# Altium project PCB_tesis.PrjPcb (part 1 of 2)
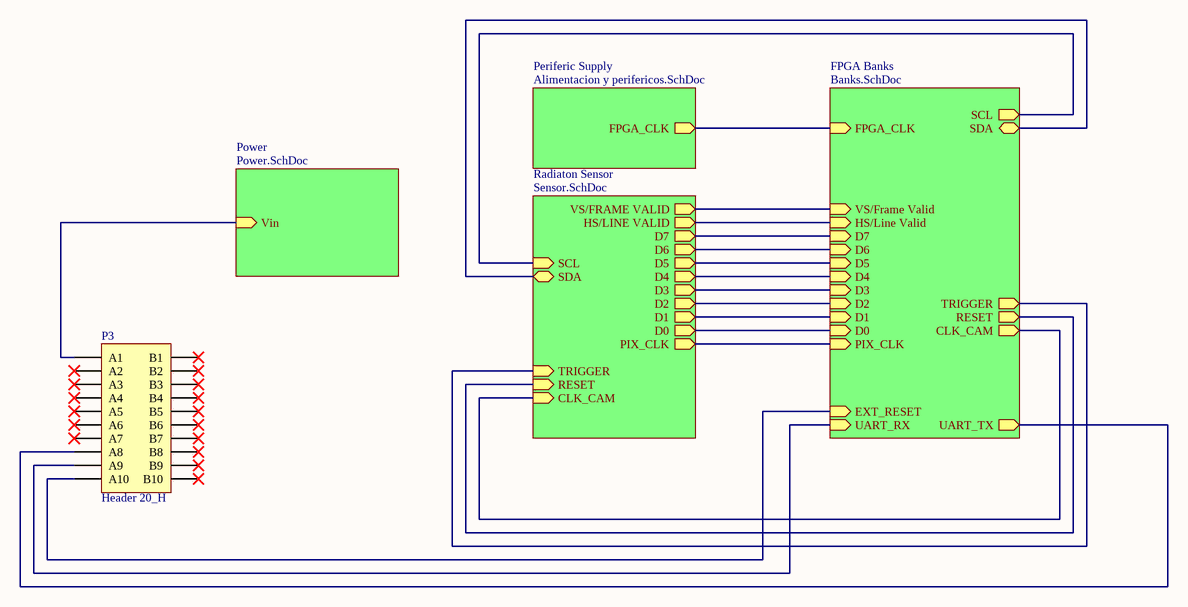
[diagram p0: Sistema.SchDoc]
4 sheets, 76 parts. Net scope: hierarchical (ports join the sheet entries above them; power ports are global).
Board file: Sistema.PcbDoc
Sheets:
  Sistema.SchDoc
    Power = Power.SchDoc
    Periferic Supply = Alimentacion y perifericos.SchDoc
    FPGA Banks = Banks.SchDoc

## Sheet Sistema.SchDoc
size A4; SheetNumber: 1; SheetTotal: 5

### Parts
P3  Header 20_H  [P_DIN41612-20-H]

### Sub-sheets
FPGA Banks = Banks.SchDoc: FPGA_CLK (in), SCL (out), SDA (bidir), VS/Frame Valid (in), HS/Line Valid (in), D7 (in), D6 (in), D5 (in), D4 (in), D3 (in), D2 (in), D1 (in), PIX_CLK (in), CLK_CAM (out), D0 (in), TRIGGER (out), RESET (out), EXT_RESET (in), UART_TX (out), UART_RX (in)
Periferic Supply = Alimentacion y perifericos.SchDoc: FPGA_CLK (out)
Power = Power.SchDoc: Vin (in)
Radiaton Sensor = Sensor.SchDoc (file not in this document): VS/FRAME VALID (out), SDA (bidir), SCL (in), RESET (in), PIX_CLK (out), HS/LINE VALID (out), D7 (out), D6 (out), D5 (out), D4 (out), D3 (out), D2 (out), D1 (out), D0 (out), CLK_CAM (in), TRIGGER (in)

### Nets
NetC9_2: P3.A10 ; sheet FPGA Banks/EXT_RESET
NetF1_1: P3.A1 ; sheet Power/Vin
NetP3_A8: P3.A8 ; sheet FPGA Banks/UART_TX
NetP3_A9: P3.A9 ; sheet FPGA Banks/UART_RX
NetR11_1: sheet Periferic Supply/FPGA_CLK, sheet FPGA Banks/FPGA_CLK
NetU7_7: sheet FPGA Banks/SCL, sheet Radiaton Sensor/SCL
NetU7_8: sheet FPGA Banks/SDA, sheet Radiaton Sensor/SDA
NetU7_9: sheet FPGA Banks/VS/Frame Valid, sheet Radiaton Sensor/VS/FRAME VALID
NetU7_10: sheet FPGA Banks/HS/Line Valid, sheet Radiaton Sensor/HS/LINE VALID
NetU7_11: sheet FPGA Banks/D7, sheet Radiaton Sensor/D7
NetU7_12: sheet FPGA Banks/D6, sheet Radiaton Sensor/D6
NetU7_15: sheet FPGA Banks/D5, sheet Radiaton Sensor/D5
NetU7_16: sheet FPGA Banks/D4, sheet Radiaton Sensor/D4
NetU7_17: sheet FPGA Banks/D3, sheet Radiaton Sensor/D3
NetU7_18: sheet FPGA Banks/D2, sheet Radiaton Sensor/D2
NetU7_19: sheet FPGA Banks/D1, sheet Radiaton Sensor/D1
NetU7_20: sheet FPGA Banks/PIX_CLK, sheet Radiaton Sensor/PIX_CLK
NetU7_21: sheet FPGA Banks/CLK_CAM, sheet Radiaton Sensor/CLK_CAM
NetU7_22: sheet FPGA Banks/D0, sheet Radiaton Sensor/D0
NetU7_23: sheet FPGA Banks/TRIGGER, sheet Radiaton Sensor/TRIGGER
NetU7_24: sheet FPGA Banks/RESET, sheet Radiaton Sensor/RESET

Not connected (* = marked no-connect by the designer): P3 A2* A3* A4* A5* A6* A7* B1* B2* B3* B4* B5* B6* B7* B8* B9* B10*

### Library data of the parts
P3 = P_Conector_20_H: Conector 20 Position Din Connector Plug, Male Pins Gold Through Hole, Right Angle; Manufacturer: HARTING Technology; Manufacturer Part Number: 09242206825; Current Rating: 2A; Gender: Female; Connector Type: Receptacle; Number of Positions: 20; Pitch: 2.54mm; Tail Length: 4.5mm; Mounting Technology: Through Hole; Contact Material: Copper Alloy; Contact Plating: Gold; Insulation Material: Glass; Housing Material: Thermoplastic; Shell Size: 3B; Packaging: Bulk; Package Quantity: 20; Number of Rows: 2; Termination: Solder; Number of Contacts: 20; Orientation: Straight; Series: DIN 41612; Lead Free: Lead Free; Flammability Rating: UL94 V-0; RoHS Compliant: Yes; ComponentLink1URL: https://datasheet.ciiva.com/11731/0900766b811d3497-11731844.pdf?src-supplier=Rs; ComponentLink1Description: https://datasheet.ciiva.com/11731/0900766b811d3497-11731844.pdf?src-supplier=Rs; Supplier 1: Mouser; Supplier Part Number 1: 617-09-24-220-6825; RoHS: Yes; Category: DIN 41612 Connectors; Stock 1: 166; Pricing 1: 1=4,87, 10=4,27, 50=4,27, 100=3,55, 1000=2,94, 10000=2,74 (USD); Value: Header 20_H

## Sheet Power.SchDoc
size A4; SheetNumber: 5; SheetTotal: 5
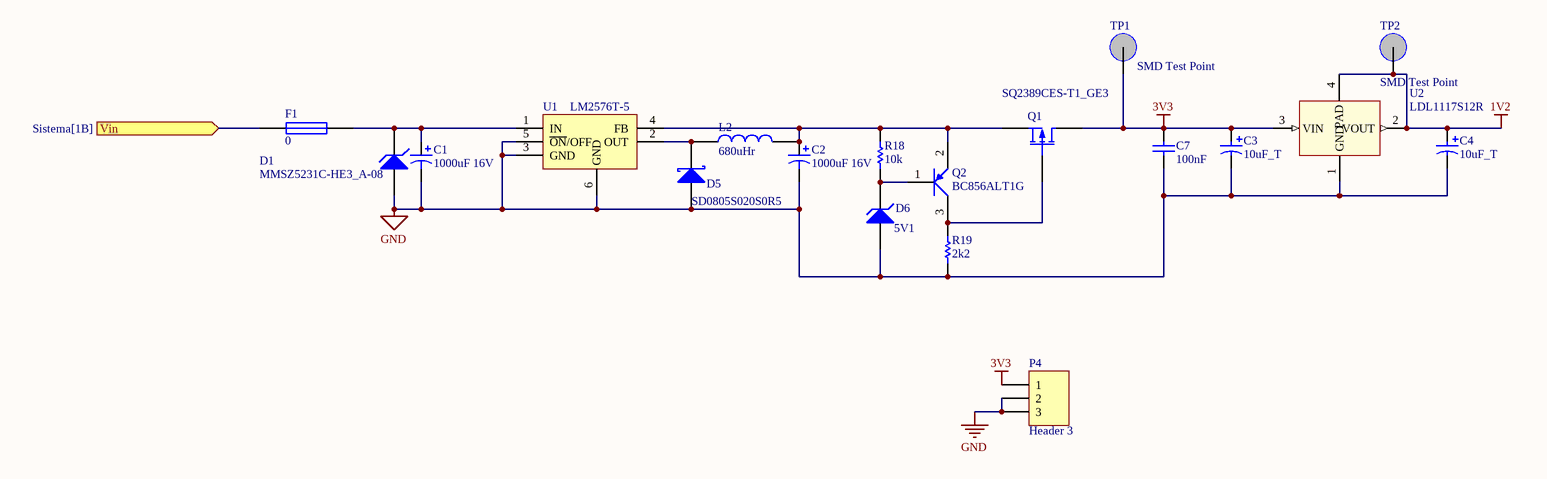
[diagram p1: Power.SchDoc]

### Parts
C1  1000uF 16V  [C_SMD_F12]
C2  1000uF 16V  [C_SMD_F12]
C3  10uF_T  [C_0805_2013_c]
C4  10uF_T  [C_0805_2013_c]
C7  100nF  [C_0805_2013_b]
D1  MMSZ5231C-HE3_A-08  [D_SOD-123]
D5  SD0805S020S0R5  [D_SOD-123]
D6  5V1  [D_SOD-123]
F1  0  [F_0805_2012]
L2  680uHr  [L_SMD_10x10]
P4  Header 3  [P_HDR1X3_3D]
Q1  SQ2389CES-T1_GE3  [Q_SOT-23]
Q2  BC856ALT1G  [Q_SOT-23B_N]
R18  10k  [R_0805_2012_a]
R19  2k2  [R_0805_2012_a]
TP1  SMD Test Point  [TP SMD]
TP2  SMD Test Point  [TP SMD]
U1  LM2576T-5  [U_SMD_TO-263-5]
U2  LDL1117S12R  [U_SOT-223]

### Ports
Vin (in, see Sistema[1B])

### Nets
1V2: C4.1 TP2.1 U2.2(VOUT) U2.4(PAD)
3V3: C3.1 C7.2 P4.1 Q1.3(D) TP1.1 U2.3(VIN)
GND: C1.2 C2.2 C3.2 C4.2 C7.1 D1.2(A) D5.2(A) D6.2(A) P4.2 P4.3 R19.2 U1.3(GND) U1.5(~{O}~{N}/OFF) U1.6(GND) U2.1(GND)
NetC1_1: C1.1 D1.1(K) F1.2 U1.1(IN)
NetC2_1: C2.1 L2.2 Q1.2(S) Q2.2(E) R18.2 U1.4(FB)
NetD5_1: D5.1(K) L2.1 U1.2(OUT)
NetD6_1: D6.1(K) Q2.1(B) R18.1
NetF1_1: F1.1 ; port Vin
NetQ1_1: Q1.1(G) Q2.3(C) R19.1

### Library data of the parts
C1 C2 = C_1000uF_16V_p: Capacitor SMD Elec F12; Manufacturer: KEMET; Manufacturer Part Number: A768MS108M1CLAE015; Supplier 1: Mouser; Supplier Part Number 1: 80-A768MS108M1CLAE15; RoHS: Yes; Category: Polymer Capacitors; Stock 1: 5839; Pricing 1: 1=0,91, 10=0,572, 50=0,572, 100=0,466, 1000=0,307, 10000=0,275 (USD); Value: 1000uF 16V
C3 C4 = C_10uF_10V_b: Capacitor SMD 0805 Tant; Manufacturer: Vishay; Manufacturer Part Number: TMCP1A106MTRF; RoHS Compliant: Yes; Supplier 1: Mouser; Supplier Part Number 1: 74-TMCP1A106MTRF; RoHS: Yes; Category: Tantalum Capacitors; Stock 1: 7293; Pricing 1: 1=0,3, 10=0,152, 50=0,152, 100=0,098, 1000=0,082, 10000=0,067 (USD); Value: 10uF_T
C7 = C_100nF_50V_b: Capacitor SMD 0805; Manufacturer: Yageo; Manufacturer Part Number: CC0805KRX7R9BB104; Material: Ceramic; Tolerance: 10%; Dielectric: X7R; Voltage: 50V; Insulation Resistance: 100GR; Mounting Technology: Surface Mount; Case/Package: 0805; Pins: 2; Case Code (Metric): 2012; Case Code (Imperial): 0805; Min Operating Temperature: -55°C; Max Operating Temperature: 125°C; Packaging: Tape and Reel; Voltage Rating: 50V; Package Quantity: 4000; Termination: SMD/SMT; Series: CC; Length: 2mm; Height: 0.85mm; Depth: 1.25mm; Radiation Hardening: No; RoHS Compliant: Yes; Reach SVHC Compliant: No; Halogen Free: 5694HalogenFree; Lead Free: 5697LeadFree; ComponentLink1URL: https://datasheet.ciiva.com/11786/0900766b80d84f1d-11786009.pdf?src-supplier=Rs; ComponentLink1Description: https://datasheet.ciiva.com/11786/0900766b80d84f1d-11786009.pdf?src-supplier=Rs; ComponentLink2URL: https://datasheet.ciiva.com/46393/1734573-46393307.pdf?src-supplier=Element14; ComponentLink2Description: https://datasheet.ciiva.com/46393/1734573-46393307.pdf?src-supplier=Element14; ComponentLink3URL: https://datasheet.ciiva.com/155/mlccorderingcode-155930.pdf?src-supplier=Digikey; ComponentLink3Description: https://datasheet.ciiva.com/155/mlccorderingcode-155930.pdf?src-supplier=Digikey; ComponentLink4URL: https://datasheet.ciiva.com/155/mlccorderingcode-155929.pdf?src-supplier=Digikey; ComponentLink4Description: https://datasheet.ciiva.com/155/mlccorderingcode-155929.pdf?src-supplier=Digikey; ComponentLink5URL: https://datasheet.ciiva.com/155/mlccorderingcode-155931.pdf?src-supplier=Digikey; ComponentLink5Description: https://datasheet.ciiva.com/155/mlccorderingcode-155931.pdf?src-supplier=Digikey; ComponentLink6URL: https://datasheet.ciiva.com/11464/upy-gphc-x7r-6-3v-to-50v-8-11464757.pdf?src-supplier=Avnet; ComponentLink6Description: https://datasheet.ciiva.com/11464/upy-gphc-x7r-6-3v-to-50v-8-11464757.pdf?src-supplier=Avnet; ComponentLink7URL: https://datasheet.ciiva.com/28450/1489800-28450805.pdf?src-supplier=Element14; ComponentLink7Description: https://datasheet.ciiva.com/28450/1489800-28450805.pdf?src-supplier=Element14; ComponentLink8URL: https://datasheet.ciiva.com/29242/445210-da-01-en-kerko-chip-0805-x7r-0-1uf-10proz-50vg-29242074.pdf?src-supplier=Conrad; ComponentLink8Description: https://datasheet.ciiva.com/29242/445210-da-01-en-kerko-chip-0805-x7r-0-1uf-10proz-50vg-29242074.pdf?src-supplier=Conrad; Supplier 1: Digikey; Supplier Part Number 1: 311-1140-1-ND; RoHS: Yes; Category: Ceramic Capacitors; Stock 1: 5306374; Pricing 1: 1=0,1, 10=0,07, 50=0,0418, 100=0,0329, 500=0,02428, 1000=0,0201 (USD); Value: 100nF
D1 = D_MMSZ5231C-HE3_A-08: Diode SMD SOD-123 Zener 5V1; Manufacturer: Vishay Semiconductors; Manufacturer Part Number: MMSZ5226C-E3-08; Zener Voltage: 3.3V; Max Power Dissipation: 500mW; Impedance: 28R; Zener Current: 20mA; Voltage Tolerance: 2%; Max Reverse Leakage Current: 25uA; Mounting Technology: Surface Mount; Weight: 0.000363oz; Min Operating Temperature: -55°C; Max Operating Temperature: 150°C; Packaging: Tape and Reel; Package Quantity: 3000; Power Dissipation: 500mW; Tolerance: 2%; Series: Automotive, AEC-Q101; RoHS Compliant: Yes; ComponentLink1URL: https://www.vishay.com/docs/86344/mmsz5225_to_mmsz5267.pdf; ComponentLink1Description: Datasheet; RoHS: Yes; Category: Zener Diodes; Stock 1: 14347; Pricing 1: 1=0,29, 10=0,198, 50=0,198, 100=0,089, 1000=0,062, 10000=0,041 (USD); Value: MMSZ5231C-HE3_A-08; Supplier 1: Mouser; Supplier Part Number 1: 78-MMSZ5231CHE3_A-08
D5 = D_SD0805S020S0R5: Diode SMD D_SD0805S020S0R5; Manufacturer: Diodes; Manufacturer Part Number: B550C-13-F; Max Reverse Current: 500uA; Forward Current: 5A; Max Repetitive Reverse Voltage (Vrrm): 50V; Peak Non-Repetitive Surge Current: 100A; Polarity: Standard; Forward Voltage: 700mV; Mounting Technology: Surface Mount; Case/Package: SMC; Pins: 2; Weight: 0.007408oz; Contact Plating: Tin,Matte; Min Operating Temperature: -55°C; Max Operating Temperature: 125°C; Package Quantity: 3000; Packaging: Tape and Reel; Current Rating: 5A; Output Current: 5A; Series: -; Average Rectified Current: 5A; Max Forward Surge Current (Ifsm): 100A; Termination: SMD/SMT; Voltage Rating (DC): 50V; Max Reverse Voltage (DC): 50V; Length: 7.11mm; Width: 6.22mm; Height: 2.5mm; Radiation Hardening: No; Lead Free: Lead Free; RoHS Compliant: Yes; Reach SVHC Compliant: No; RoHS: Yes; Category: Rectifier Diodes; Stock 1: 65197; Pricing 1: 1=0,56, 10=0,476, 100=0,3309, 500=0,25834, 1000=0,20998 (USD); Value: SD0805S020S0R5; Supplier 1: Digikey; Supplier Part Number 1: 478-7799-1-ND
D6 = D_DDZ5V1B-7: Zener Diode; Manufacturer: Diodes; Max Power Dissipation: 500mW; Zener Voltage: 5.1V; Max Reverse Leakage Current: 5uA; Tolerance: 3%; Forward Voltage: 900mV; Impedance: 17R; Test Current: 20mA; Output Current: 40mA; Mounting Technology: Surface Mount; Case/Package: SOD-123-2; Pins: 2; Weight: 0.000353oz; Min Operating Temperature: -65°C; Max Operating Temperature: 150°C; Package Quantity: 3000; Packaging: Tape and Reel; Voltage Tolerance: 3%; Power Rating: 500mW; Series: -; Zener Current: 5uA; Max Reverse Current: 5uA; Power Dissipation: 500mW; Working Voltage: 5.1V; Termination: SMD/SMT; Voltage Rating (DC): 5.1V; Length: 3.85mm; Width: 1.7mm; Height: 1.35mm; Radiation Hardening: No; RoHS Compliant: Yes; Lead Free: Lead Free; ComponentLink1URL: http://components.arrow.com/part/dataview/41508659S7354897N2868?src-supplier=Arrow+Electronics; ComponentLink1Description: http://components.arrow.com/part/dataview/41508659S7354897N2868?src-supplier=Arrow+Electronics; ComponentLink2URL: http://www.mouser.com/ds/2/115/ds30407-71565.pdf?src-supplier=Mouser; ComponentLink2Description: http://www.mouser.com/ds/2/115/ds30407-71565.pdf?src-supplier=Mouser; ComponentLink3URL: http://www.diodes.com///datasheets/ds30407.pdf?src-supplier=Avnet; ComponentLink3Description: http://www.diodes.com///datasheets/ds30407.pdf?src-supplier=Avnet; ComponentLink4URL: http://www.diodes.com//datasheets/ds30407.pdf?src-supplier=Avnet; ComponentLink4Description: http://www.diodes.com//datasheets/ds30407.pdf?src-supplier=Avnet; ComponentLink5URL: https://datasheet.octopart.com/DDZ5V1B-7-Diodes-Inc.-datasheet-160462869.pdf?src-supplier=Farnell; ComponentLink5Description: https://datasheet.octopart.com/DDZ5V1B-7-Diodes-Inc.-datasheet-160462869.pdf?src-supplier=Farnell; ComponentLink6URL: http://www.diodes.com/_files/datasheets/ds30407.pdf?src-supplier=Future+Electronics; ComponentLink6Description: http://www.diodes.com/_files/datasheets/ds30407.pdf?src-supplier=Future+Electronics; ComponentLink7URL: https://www.diodes.com/assets/Datasheets/Ds30407.pdf?src-supplier=Digikey; ComponentLink7Description: https://www.diodes.com/assets/Datasheets/Ds30407.pdf?src-supplier=Digikey; ComponentLink8URL: https://datasheet.octopart.com/DDZ5V1B-7-Diodes-Inc.-datasheet-22952792.pdf?src-supplier=Future+Electronics; ComponentLink8Description: https://datasheet.octopart.com/DDZ5V1B-7-Diodes-Inc.-datasheet-22952792.pdf?src-supplier=Future+Electronics; ComponentLink9URL: https://www.verical.com/server-webapp/html/getDatasheet?partID=95733&src-supplier=Verical; ComponentLink9Description: https://www.verical.com/server-webapp/html/getDatasheet?partID=95733&src-supplier=Verical; Supplier 1: Digikey; Supplier Part Number 1: DDZ5V1BDICT-ND; Manufacturer Part Number: DDZ5V1B-7; RoHS: Yes; Category: Zener Diodes; Stock 1: 88257; Pricing 1: 1=0,25, 10=0,172, 100=0,084, 500=0,07006, 1000=0,04868 (USD); Supplier 2: Mouser; Supplier Part Number 2: 621-DDZ5V1B-7; Stock 2: 108934; Pricing 2: 1=0,24, 10=0,161, 50=0,161, 100=0,084, 1000=0,048, 10000=0,028 (USD); Value: 5V1
F1 = F_?_0805: (Generico) Fuse SMD 0805; Origin: TAIWAN; Published: 8-Jun-2000; LatestRevisionDate: 17-Jul-2002; LatestRevisionNote: Re-released for DXP Platform.; PackageReference: PIN-W2/E2.8; Publisher: Altium Limited; PackageDescription: Thru-Hole; 2 Leads; Supplier 1: Digi-Key; Supplier Part Number 1: SF-1206S200-2CT-ND; Value: 0
L2 = L_?_5: (Generico)  Inductor SMD 10x10; Value: 0
P4 = P_Header 3: Header, 3-Pin; Value: Header 3
Q1 = Q_SQ2389CES-T1_GE3: Value: SQ2389CES-T1_GE3; Supplier 1: Mouser; Supplier Part Number 1: 78-SQ2389CES-T1_GE3
Q2 = Q_BC856: TRANS PNP 65V 0.1A SOT23; Manufacturer: ON Semiconductor; Max Power Dissipation: 300mW; Max Collector Current: 100mA; Transition Frequency: 100MHz; Emitter Base Voltage (VEBO): 5V; Collector Base Voltage (VCBO): 80V; Collector Emitter Saturation Voltage: -650mV; Collector-emitter Voltage-Max: 650mV; hFE Min: 125; Number of Elements: 1; Voltage Rating (DC): -65V; Current Rating: -100mA; ComponentLink1Description: Manufacturer Link; ComponentLink1URL: http://www.fairchildsemi.com/; ComponentLink2Description: Datasheet; ComponentLink2URL: http://www.fairchildsemi.com/ds/2N%2F2N3904.pdf; Case/Package: SOT-23-3; Pins: 3; Contact Plating: Tin,Matte; Min Operating Temperature: -55°C; Max Operating Temperature: 150°C; Package Quantity: 3000; Packaging: Tape and Reel; Collector Emitter Breakdown Voltage: 65V; Polarity: PNP; Clock Frequency: 100MHz; Gain Bandwidth Product: 100MHz; Series: -; Collector Emitter Voltage (VCEO): 65V; Frequency: 100MHz; Max Breakdown Voltage: 65V; Power Dissipation: 300mW; Length: 2.9mm; Width: 1.3mm; Height: 0.94mm; Radiation Hardening: No; Lead Free: Lead Free; RoHS Compliant: Yes; Reach SVHC Compliant: No; ComponentLink3URL: http://www.farnell.com/datasheets/1840529.pdf?src-supplier=Farnell; ComponentLink3Description: http://www.farnell.com/datasheets/1840529.pdf?src-supplier=Farnell; ComponentLink4URL: http://www.alliedelec.com/m/d/ae2fff4c1f3549b23e4cd9e6cc054b51.pdf?src-supplier=Allied+Electronics; ComponentLink4Description: http://www.alliedelec.com/m/d/ae2fff4c1f3549b23e4cd9e6cc054b51.pdf?src-supplier=Allied+Electronics; ComponentLink5URL: http://www.mouser.com/ds/2/308/BC856ALT1-D-249456.pdf?src-supplier=Mouser; ComponentLink5Description: http://www.mouser.com/ds/2/308/BC856ALT1-D-249456.pdf?src-supplier=Mouser; ComponentLink6URL: http://www.farnell.com/datasheets/1840529.pdf?src-supplier=Element14; ComponentLink6Description: http://www.farnell.com/datasheets/1840529.pdf?src-supplier=Element14; ComponentLink7URL: http://www.farnell.com/datasheets/1840529.pdf?src-supplier=Newark; ComponentLink7Description: http://www.farnell.com/datasheets/1840529.pdf?src-supplier=Newark; Supplier Part Number 1: 863-BC856ALT1G; Manufacturer Part Number: BC856ALT1G; RoHS: Yes; Category: BJTs; Stock 1: 30566; Pricing 1: 1=0,11, 10=0,071, 50=0,071, 100=0,034, 1000=0,021, 10000=0,015 (USD); Value: BC856ALT1G; Supplier 1: Mouser
R18 = R_10k_b: Resistor SMD 0805; Manufacturer: Yageo; Manufacturer Part Number: AC0805FR-0710KL; Tolerance: 1%; Power Rating: 125mW; Voltage Rating: 150V; Temperature Coefficient: 100ppm/°C; Case/Package: 0805; Case Code (Metric): 2012; Case Code (Imperial): 0805; Min Operating Temperature: -55°C; Max Operating Temperature: 155°C; Packaging: Tape and Reel; Package Quantity: 1; Number of Terminations: 2; Termination: SMD/SMT; Max Power Dissipation: 125mW; Features: Moisture Resistant,Automotive AEC-Q200,Anti-Sulfur; Series: AC; Construction: Rectangular; Length: 0.079inch; Width: 0.049inch; Height: 0.024inch; Depth: 1.25mm; Military Standard: Not; Lead Free: Lead Free; RoHS Compliant: Yes; ComponentLink1URL: http://www.yageo.com/NewPortal/yageodocoutput?fileName=/pdf/R-Chip/PYu-AC_51_RoHS_L_6.pdf&src-supplier=Digikey; ComponentLink1Description: http://www.yageo.com/NewPortal/yageodocoutput?fileName=/pdf/R-Chip/PYu-AC_51_RoHS_L_6.pdf&src-supplier=Digikey; ComponentLink2URL: http://www.yageo.com/documents/recent/PYu-AC_51_RoHS_L_2_revised.pdf?src-supplier=Future+Electronics; ComponentLink2Description: http://www.yageo.com/documents/recent/PYu-AC_51_RoHS_L_2_revised.pdf?src-supplier=Future+Electronics; ComponentLink3URL: http://www.yageo.com/NewPortal/yageodocoutput?fileName=/pdf/R-Chip/PYu-AC_51_RoHS_L_6.pdf&src-supplier=NAC+Semi; ComponentLink3Description: http://www.yageo.com/NewPortal/yageodocoutput?fileName=/pdf/R-Chip/PYu-AC_51_RoHS_L_6.pdf&src-supplier=NAC+Semi; ComponentLink4URL: http://www.yageo.com/NewPortal/yageodocoutput?fileName=/pdf/R-Chip/PYu-AC_51_RoHS_L_6.pdf&src-supplier=Rutronik; ComponentLink4Description: http://www.yageo.com/NewPortal/yageodocoutput?fileName=/pdf/R-Chip/PYu-AC_51_RoHS_L_6.pdf&src-supplier=Rutronik; Supplier 1: Digikey; Supplier Part Number 1: 311-10KLGCT-ND; RoHS: Yes; Category: Chip SMD Resistors; Stock 1: 480247; Pricing 1: 1=0,1, 10=0,031, 50=0,0198, 100=0,0166, 500=0,01152, 1000=0,00997 (USD); Value: 10k
R19 = R_2k2_b: Resistor SMD 0805; Manufacturer: Bourns; Manufacturer Part Number: CR0805-FX-2201ELF; Voltage Rating: 150V; Tolerance: 1%; Power Rating: 125mW; Temperature Coefficient: 100ppm/°C; Mounting Technology: Surface Mount; Case/Package: 0805; Contact Plating: Tin; Case Code (Imperial): 0805; Case Code (Metric): 2012; Min Operating Temperature: -55°C; Max Operating Temperature: 155°C; Packaging: Tape and Reel; Package Quantity: 5000; Termination: SMD/SMT; Series: CR0805; Resistor Type: Thick Film; Voltage Rating (DC): 150V; Resistance Tolerance: 1%; Length: 2mm; Width: 1.25mm; Height: 0.5mm; Thickness: 508um; Radiation Hardening: No; RoHS Compliant: Yes; Reach SVHC Compliant: No; ComponentLink1URL: https://datasheet.ciiva.com/22713/691949-22713256.pdf?src-supplier=Element14; ComponentLink1Description: https://datasheet.ciiva.com/22713/691949-22713256.pdf?src-supplier=Element14; ComponentLink2URL: https://datasheet.ciiva.com/5541/chpreztr-5541000.pdf?src-supplier=Mouser; ComponentLink2Description: https://datasheet.ciiva.com/5541/chpreztr-5541000.pdf?src-supplier=Mouser; Supplier 1: Digikey; Supplier Part Number 1: 118-CR0805-FX-2201ELFCT-ND; RoHS: Yes; Category: Chip SMD Resistors; Stock 1: 80126; Pricing 1: 1=0,1, 10=0,021, 50=0,0132, 100=0,011, 500=0,00744, 1000=0,00639 (USD); Value: 2k2
TP1 TP2 = P_T_TP: Test Point SMD; Origin: CHINA; Published: 8-Jun-2000; LatestRevisionDate: 17-Jul-2002; LatestRevisionNote: Re-released for DXP Platform.; PackageReference: AXIAL-0.3; Publisher: Altium Limited; PackageDescription: Axial Device, Thru-Hole; 2 Leads; 0.3 in Pin Spacing; Supplier 1: Mouser; Supplier Part Number 1: 279-RCT-0C; Type: CONNECTOR; Value: SMD Test Point
U1 = U_LM2576-3.3WU: Value: LM2576T-5; Supplier 1: Mouser; Supplier Part Number 1: 998-LM2576-3.3WUTR
U2 = U_LDL1117: LDL1117 Series 1.2 A 2.5 V High PSRR LDO Linear Voltage Regulator-SOT-223; Manufacturer: STMicroelectronics; Manufacturer Part Number: LDL1117S25R; Output Type: Fixed; Output Configuration: Positive; Number of Regulators: 1; Max Supply Voltage: 18V; Min Output Voltage: 2.5V; Output Current: 1.2A; Quiescent Current: 500uA; Power Supply Rejection Ratio (PSRR): 65dB; Accuracy: 2%; Min Supply Voltage: 2.6V; Nominal Supply Current: 250uA; Number of Channels: 1NUMBER; Value: LDL1117S25R; Mounting Technology: Surface Mount; Case/Package: TO-261-4; Min Operating Temperature: -40°C; Max Operating Temperature: 125°C; Packaging: Cut Tape; Series: -; Number of Outputs: 1NUMBER; Output Voltage: 2.5V; Height: 1.8mm; RoHS Compliant: Yes; ComponentLink1URL: http://www.farnell.com/datasheets/2342741.pdf?src-supplier=Farnell; ComponentLink1Description: http://www.farnell.com/datasheets/2342741.pdf?src-supplier=Farnell; ComponentLink2URL: http://www.st.com/content/ccc/resource/technical/document/datasheet/group3/0e/5a/00/ca/10/1a/4f/a5/DM00366442/files/DM00366442.pdf/jcr:content/translations/en.DM00366442.pdf?src-supplier=Digikey; ComponentLink2Description: http://www.st.com/content/ccc/resource/technical/document/datasheet/group3/0e/5a/00/ca/10/1a/4f/a5/DM00366442/files/DM00366442.pdf/jcr:content/translations/en.DM00366442.pdf?src-supplier=Digikey; ComponentLink3URL: https://datasheet.octopart.com/LDL1117S25R-STMicroelectronics-datasheet-165583407.pdf?src-supplier=TME; ComponentLink3Description: https://datasheet.octopart.com/LDL1117S25R-STMicroelectronics-datasheet-165583407.pdf?src-supplier=TME; Supplier 1: Mouser; Supplier Part Number 1: 511-LDL1117S25R; RoHS: Yes; Category: Voltage Regulators - Linear; Stock 1: 10345; Pricing 1: 1=1,1, 10=0,98, 50=0,935, 100=0,757, 1000=0,478, 10000=0,415 (USD)

## Sheet Alimentacion y perifericos.SchDoc
size A4; SheetNumber: 3; SheetTotal: 5
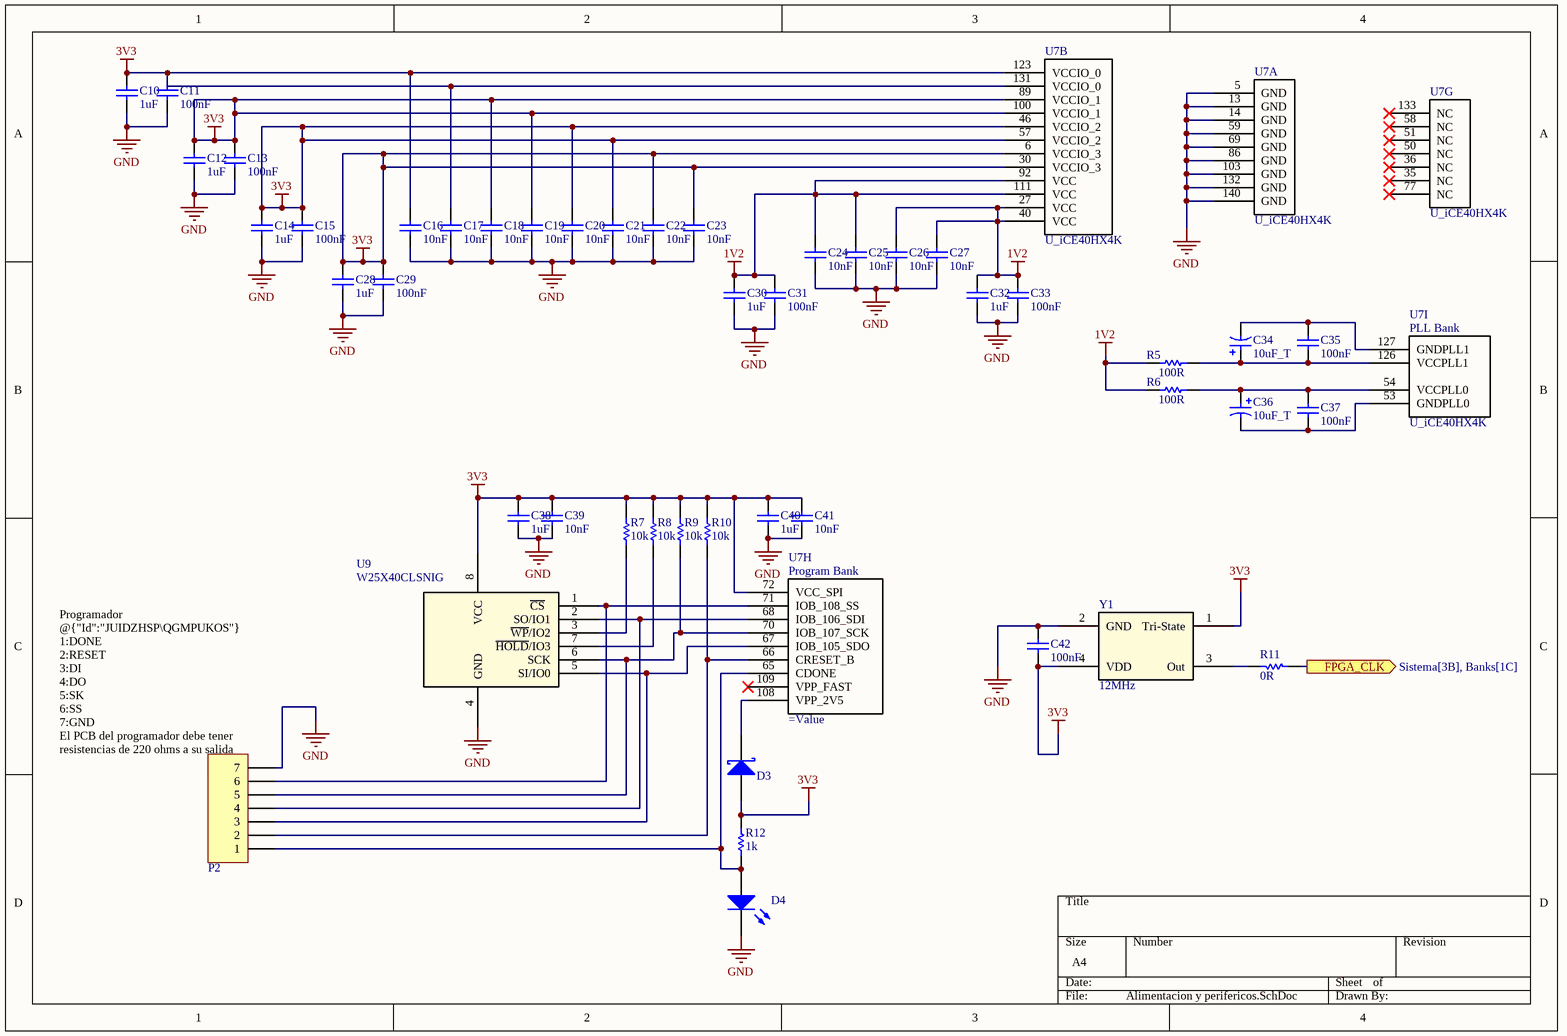
[diagram p2: Alimentacion y perifericos.SchDoc]

### Parts
C10  1uF  [C_0805_2013_b]
C11  100nF  [C_0805_2013_b]
C12  1uF  [C_0805_2013_b]
C13  100nF  [C_0805_2013_b]
C14  1uF  [C_0805_2013_b]
C15  100nF  [C_0805_2013_b]
C16  10nF  [C_0805_2013_b]
C17  10nF  [C_0805_2013_b]
C18  10nF  [C_0805_2013_b]
C19  10nF  [C_0805_2013_b]
C20  10nF  [C_0805_2013_b]
C21  10nF  [C_0805_2013_b]
C22  10nF  [C_0805_2013_b]
C23  10nF  [C_0805_2013_b]
C24  10nF  [C_0805_2013_b]
C25  10nF  [C_0805_2013_b]
C26  10nF  [C_0805_2013_b]
C27  10nF  [C_0805_2013_b]
C28  1uF  [C_0805_2013_b]
C29  100nF  [C_0805_2013_b]
C30  1uF  [C_0805_2013_b]
C31  100nF  [C_0805_2013_b]
C32  1uF  [C_0805_2013_b]
C33  100nF  [C_0805_2013_b]
C34  10uF_T  [C_0805_2013_c]
C35  100nF  [C_0805_2013_b]
C36  10uF_T  [C_0805_2013_c]
C37  100nF  [C_0805_2013_b]
C38  1uF  [C_0805_2013_b]
C39  10nF  [C_0805_2013_b]
C40  1uF  [C_0805_2013_b]
C41  10nF  [C_0805_2013_b]
C42  100nF  [C_0805_2013_b]
D3  SD0805S020S0R5  [D_SOD-123]  (value not drawn)
D4  GREEN  [D_LED_0805_2013]  (value not drawn)
P2  PROGRAM  [P_CON1X7]  (value not drawn)
R5  100R  [R_0805_2012_a]
R6  100R  [R_0805_2012_a]
R7  10k  [R_0805_2012_a]
R8  10k  [R_0805_2012_a]
R9  10k  [R_0805_2012_a]
R10  10k  [R_0805_2012_a]
R11  0R  [R_0805_2012_a]
R12  1k  [R_0805_2012_a]
U7  U_iCE40HX4K  [U_TQFP-144]  (parts A,B,G,H,I of 9)
U9  W25X40CLSNIG  [U_SOIC-8_2]
Y1  12MHz  [Y_SMD-XTAL-12MHz]

### Ports
FPGA_CLK (out, see Sistema[3B], Banks[1C])

### Nets
1V2: C24.1 C25.1 C26.1 C27.1 C30.2 C31.2 C32.2 C33.2 R5.1 R6.1 U7.27(VCC) U7.40(VCC) U7.92(VCC) U7.111(VCC)
3V3: C10.2 C11.2 C12.2 C13.2 C14.2 C15.2 C16.1 C17.1 C18.1 C19.1 C20.1 C21.1 C22.1 C23.1 C28.2 C29.2 C38.2 C39.2 C40.2 C41.2 C42.1 D3.2(A) R7.2 R8.2 R9.2 R10.2 R12.1 U7.6(VCCIO_3) U7.30(VCCIO_3) U7.46(VCCIO_2) U7.57(VCCIO_2) U7.72(VCC_SPI) U7.89(VCCIO_1) U7.100(VCCIO_1) U7.123(VCCIO_0) U7.131(VCCIO_0) U9.8(VCC) Y1.1(Tri-State) Y1.4(VDD)
GND: C10.1 C11.1 C12.1 C13.1 C14.1 C15.1 C16.2 C17.2 C18.2 C19.2 C20.2 C21.2 C22.2 C23.2 C24.2 C25.2 C26.2 C27.2 C28.1 C29.1 C30.1 C31.1 C32.1 C33.1 C38.1 C39.1 C40.1 C41.1 C42.2 D4.1(K) P2.7 U7.5(GND) U7.13(GND) U7.14(GND) U7.59(GND) U7.69(GND) U7.86(GND) U7.103(GND) U7.132(GND) U7.140(GND) U9.4(GND) Y1.2(GND)
NetC34_1: C34.1 C35.1 R5.2 U7.126(VCCPLL1)
NetC34_2: C34.2 C35.2 U7.127(GNDPLL1)
NetC36_1: C36.1 C37.1 R6.2 U7.54(VCCPLL0)
NetC36_2: C36.2 C37.2 U7.53(GNDPLL0)
NetD3_1: D3.1(K) U7.108(VPP_2V5)
NetD4_2: D4.2(A) P2.1 R12.2 U7.65(CDONE)
NetP2_2: P2.2 R10.1 U7.66(CRESET_B)
NetP2_3: P2.3 U7.67(IOB_105_SDO) U9.5(SI/IO0)
NetP2_4: P2.4 U7.68(IOB_106_SDI) U9.2(SO/IO1)
NetP2_5: P2.5 R9.1 U7.70(IOB_107_SCK) U9.6(SCK)
NetP2_6: P2.6 U7.71(IOB_108_SS) U9.1(~{CS})
NetR7_1: R7.1 U9.3(~{WP}/IO2)
NetR8_1: R8.1 U9.7(~{HOLD}/IO3)
NetR11_1: R11.1 ; port FPGA_CLK
NetR11_2: R11.2 Y1.3(Out)

Not connected (* = marked no-connect by the designer): U7 35(NC)* 36(NC)* 50(NC)* 51(NC)* 58(NC)* 77(NC)* 109(VPP_FAST)* 133(NC)*

### Notes on the sheet
- (near P2) Programador @{"Id":"JUIDZHSP\QGMPUKOS"}
  1:DONE
  2:RESET
  3:DI
  4:DO
  5:SK
  6:SS
  7:GND
  El PCB del programador debe tener resistencias de 220 ohms a su salida
- (in symbol U_iCE40HX4K, part H) Program Bank
- (in symbol U_iCE40HX4K, part I) PLL Bank

### Library data of the parts
C10 C12 C14 C28 C30 C32 C38 C40 = C_1uF_50V_b: Capacitor SMD 0805; Manufacturer: Cal-Chip Electronics; Manufacturer Part Number: GMC21X7R105K50NT; Supplier 1: Digikey; Supplier Part Number 1: 4713-GMC21X7R105K50NTCT-ND; RoHS: Yes; Category: Ceramic Capacitors; Stock 1: 1410; Pricing 1: 1=0,16, 10=0,106, 50=0,0632, 100=0,0497, 500=0,03672, 1000=0,0304 (USD); Value: 1uF; JLCPCB Part #: C17287262
C11 C13 C15 C29 C31 C33 C35 C37 C42 = C_100nF_50V_b: as C7 on sheet Power; Mounting Technology: Surface Mount; Case/Package: 0805; Pins: 2; Case Code (Metric): 2012; Case Code (Imperial): 0805; Min Operating Temperature: -55°C; Max Operating Temperature: 125°C; Packaging: Tape and Reel; Voltage Rating: 50V; Package Quantity: 4000; Termination: SMD/SMT; Series: CC; Length: 2mm; Height: 0.85mm; Depth: 1.25mm; Radiation Hardening: No; RoHS Compliant: Yes; Reach SVHC Compliant: No; Halogen Free: 5694HalogenFree; Lead Free: 5697LeadFree; ComponentLink1URL: https://datasheet.ciiva.com/11786/0900766b80d84f1d-11786009.pdf?src-supplier=Rs; ComponentLink1Description: https://datasheet.ciiva.com/11786/0900766b80d84f1d-11786009.pdf?src-supplier=Rs; ComponentLink2URL: https://datasheet.ciiva.com/46393/1734573-46393307.pdf?src-supplier=Element14; ComponentLink2Description: https://datasheet.ciiva.com/46393/1734573-46393307.pdf?src-supplier=Element14; ComponentLink3URL: https://datasheet.ciiva.com/155/mlccorderingcode-155930.pdf?src-supplier=Digikey; ComponentLink3Description: https://datasheet.ciiva.com/155/mlccorderingcode-155930.pdf?src-supplier=Digikey; ComponentLink4URL: https://datasheet.ciiva.com/155/mlccorderingcode-155929.pdf?src-supplier=Digikey; ComponentLink4Description: https://datasheet.ciiva.com/155/mlccorderingcode-155929.pdf?src-supplier=Digikey; ComponentLink5URL: https://datasheet.ciiva.com/155/mlccorderingcode-155931.pdf?src-supplier=Digikey; ComponentLink5Description: https://datasheet.ciiva.com/155/mlccorderingcode-155931.pdf?src-supplier=Digikey; ComponentLink6URL: https://datasheet.ciiva.com/11464/upy-gphc-x7r-6-3v-to-50v-8-11464757.pdf?src-supplier=Avnet; ComponentLink6Description: https://datasheet.ciiva.com/11464/upy-gphc-x7r-6-3v-to-50v-8-11464757.pdf?src-supplier=Avnet; ComponentLink7URL: https://datasheet.ciiva.com/28450/1489800-28450805.pdf?src-supplier=Element14; ComponentLink7Description: https://datasheet.ciiva.com/28450/1489800-28450805.pdf?src-supplier=Element14; ComponentLink8URL: https://datasheet.ciiva.com/29242/445210-da-01-en-kerko-chip-0805-x7r-0-1uf-10proz-50vg-29242074.pdf?src-supplier=Conrad; ComponentLink8Description: https://datasheet.ciiva.com/29242/445210-da-01-en-kerko-chip-0805-x7r-0-1uf-10proz-50vg-29242074.pdf?src-supplier=Conrad; Supplier 1: Digikey; Supplier Part Number 1: 311-1140-1-ND; RoHS: Yes; Category: Ceramic Capacitors; Stock 1: 5306374; Pricing 1: 1=0,1, 10=0,07, 50=0,0418, 100=0,0329, 500=0,02428, 1000=0,0201 (USD); Value: 100nF
C16-C27 C39 C41 = C_10nF_50V_b: Capacitor SMD 0805; Manufacturer: KEMET; Manufacturer Part Number: C0805C103J5RAC7210; Dielectric Material: Ceramic; Tolerance: 5%; Voltage Rating: 50V; Dielectric: X7R; Case/Package: 0805; Case Code (Imperial): 0805; Case Code (Metric): 2012; Min Operating Temperature: -55°C; Max Operating Temperature: 125°C; Packaging: Tape and Reel; Package Quantity: 10000; Voltage Rating (DC): 50V; Termination: SMD/SMT; Series: SMD Comm X7R; Length: 2mm; Lead Pitch: 0.75mm; Depth: 1.25mm; RoHS Compliant: Yes; ComponentLink1URL: http://www.mouser.com/ds/2/212/KEM_C1002_X7R_SMD-1102033.pdf?src-supplier=Mouser; ComponentLink1Description: http://www.mouser.com/ds/2/212/KEM_C1002_X7R_SMD-1102033.pdf?src-supplier=Mouser; ComponentLink2URL: http://components.arrow.com/part/dataview/3450688S9650973N7429?src-supplier=Arrow+Electronics; ComponentLink2Description: http://components.arrow.com/part/dataview/3450688S9650973N7429?src-supplier=Arrow+Electronics; ComponentLink3URL: https://datasheet.octopart.com/C0805C103J5RAC7210-KEMET-datasheet-68331906.pdf?src-supplier=Farnell; ComponentLink3Description: https://datasheet.octopart.com/C0805C103J5RAC7210-KEMET-datasheet-68331906.pdf?src-supplier=Farnell; ComponentLink4URL: https://api.kemet.com/component-edge/download/datasheet/C0805C103J5RAC7210.pdf?src-supplier=Digikey; ComponentLink4Description: https://api.kemet.com/component-edge/download/datasheet/C0805C103J5RAC7210.pdf?src-supplier=Digikey; ComponentLink5URL: https://datasheet.octopart.com/C0805C103J5RAC7210-KEMET-datasheet-37550250.pdf?src-supplier=Electro+Sonic; ComponentLink5Description: https://datasheet.octopart.com/C0805C103J5RAC7210-KEMET-datasheet-37550250.pdf?src-supplier=Electro+Sonic; ComponentLink6URL: https://datasheet.octopart.com/C0805C103J5RAC7210-KEMET-datasheet-166547538.pdf?src-supplier=TME; ComponentLink6Description: https://datasheet.octopart.com/C0805C103J5RAC7210-KEMET-datasheet-166547538.pdf?src-supplier=TME; Supplier 1: Mouser; Supplier Part Number 1: 80-C0805C103J5R7210; RoHS: Yes; Category: Ceramic Capacitors; Stock 1: 30128; Pricing 1: 1=0,1, 10=0,034, 50=0,034, 100=0,02, 1000=0,014, 10000=0,009 (USD); Value: 10nF
C34 C36 = C_10uF_10V_b: as C3 on sheet Power; RoHS Compliant: Yes; Supplier 1: Mouser; Supplier Part Number 1: 74-TMCP1A106MTRF; RoHS: Yes; Category: Tantalum Capacitors; Stock 1: 7293; Pricing 1: 1=0,3, 10=0,152, 50=0,152, 100=0,098, 1000=0,082, 10000=0,067 (USD); Value: 10uF_T
D3 = D_SD0805S020S0R5: as D5 on sheet Power; Mounting Technology: Surface Mount; Case/Package: SMC; Pins: 2; Weight: 0.007408oz; Contact Plating: Tin,Matte; Min Operating Temperature: -55°C; Max Operating Temperature: 125°C; Package Quantity: 3000; Packaging: Tape and Reel; Current Rating: 5A; Output Current: 5A; Series: -; Average Rectified Current: 5A; Max Forward Surge Current (Ifsm): 100A; Termination: SMD/SMT; Voltage Rating (DC): 50V; Max Reverse Voltage (DC): 50V; Length: 7.11mm; Width: 6.22mm; Height: 2.5mm; Radiation Hardening: No; Lead Free: Lead Free; RoHS Compliant: Yes; Reach SVHC Compliant: No; RoHS: Yes; Category: Rectifier Diodes; Stock 1: 65197; Pricing 1: 1=0,56, 10=0,476, 100=0,3309, 500=0,25834, 1000=0,20998 (USD); Value: SD0805S020S0R5; Supplier 1: Digikey; Supplier Part Number 1: 478-7799-1-ND
D4 = D_LED_SMD_0805: (Modificar) Diode SMD 0805; Value: GREEN
P2 = P_BORNERA 7: Bornera 7; Value: BORNERA 6 ENCH
R5 R6 = R_100R_b: Resistor SMD 0805; Manufacturer: Vishay Dale; Manufacturer Part Number: CRCW0805100RFKEA; Tolerance: 1%; Power Rating: 125mW; Voltage Rating: 150V; Temperature Coefficient: 100ppm/°C; Case/Package: 0805; Pins: 2NUMBER; Weight: 0.000194oz; Case Code (Metric): 2012; Case Code (Imperial): 0805; Contact Plating: Tin; Min Operating Temperature: -55°C; Max Operating Temperature: 155°C; Package Quantity: 10; Packaging: Tape and Reel; Resistor Type: Thick Film; Number of Terminations: 2; Termination: SMD/SMT; Max Power Dissipation: 125mW; Features: Automotive AEC-Q200; Series: CRCW; Technology: THICK FILM; Construction: Rectangular; Resistance Tolerance: 1%; Voltage Rating (DC): 150V; Length: 2mm; Width: 0.049inch; Height: 0.45mm; Depth: 1.25mm; Radiation Hardening: No; RoHS Compliant: Yes; Lead Free: 5697LeadFree; Military Standard: Not; Reach SVHC Compliant: Unknown; ComponentLink1URL: https://datasheet.ciiva.com/2495/dcrcwe3-2495842.pdf?src-supplier=Digikey; ComponentLink1Description: https://datasheet.ciiva.com/2495/dcrcwe3-2495842.pdf?src-supplier=Digikey; ComponentLink2URL: https://datasheet.ciiva.com/16760/70201119-16760940.pdf?src-supplier=Allied+Electronics; ComponentLink2Description: https://datasheet.ciiva.com/16760/70201119-16760940.pdf?src-supplier=Allied+Electronics; ComponentLink3URL: https://datasheet.ciiva.com/16777/70201119-16777129.pdf?src-supplier=Allied+Electronics; ComponentLink3Description: https://datasheet.ciiva.com/16777/70201119-16777129.pdf?src-supplier=Allied+Electronics; ComponentLink4URL: https://datasheet.ciiva.com/5546/dcrcwe3-109170-5546700.pdf?src-supplier=Mouser; ComponentLink4Description: https://datasheet.ciiva.com/5546/dcrcwe3-109170-5546700.pdf?src-supplier=Mouser; Supplier 1: Mouser; Supplier Part Number 1: 71-CRCW0805-100-E3; RoHS: Yes; Category: Chip SMD Resistors; Stock 1: 173839; Pricing 1: 1=0,1, 10=0,025, 50=0,025, 100=0,015, 1000=0,012, 10000=0,008 (USD); Value: 100R
R7-R10 = R_10k_b: as R18 on sheet Power; Case/Package: 0805; Case Code (Metric): 2012; Case Code (Imperial): 0805; Min Operating Temperature: -55°C; Max Operating Temperature: 155°C; Packaging: Tape and Reel; Package Quantity: 1; Number of Terminations: 2; Termination: SMD/SMT; Max Power Dissipation: 125mW; Features: Moisture Resistant,Automotive AEC-Q200,Anti-Sulfur; Series: AC; Construction: Rectangular; Length: 0.079inch; Width: 0.049inch; Height: 0.024inch; Depth: 1.25mm; Military Standard: Not; Lead Free: Lead Free; RoHS Compliant: Yes; ComponentLink1URL: http://www.yageo.com/NewPortal/yageodocoutput?fileName=/pdf/R-Chip/PYu-AC_51_RoHS_L_6.pdf&src-supplier=Digikey; ComponentLink1Description: http://www.yageo.com/NewPortal/yageodocoutput?fileName=/pdf/R-Chip/PYu-AC_51_RoHS_L_6.pdf&src-supplier=Digikey; ComponentLink2URL: http://www.yageo.com/documents/recent/PYu-AC_51_RoHS_L_2_revised.pdf?src-supplier=Future+Electronics; ComponentLink2Description: http://www.yageo.com/documents/recent/PYu-AC_51_RoHS_L_2_revised.pdf?src-supplier=Future+Electronics; ComponentLink3URL: http://www.yageo.com/NewPortal/yageodocoutput?fileName=/pdf/R-Chip/PYu-AC_51_RoHS_L_6.pdf&src-supplier=NAC+Semi; ComponentLink3Description: http://www.yageo.com/NewPortal/yageodocoutput?fileName=/pdf/R-Chip/PYu-AC_51_RoHS_L_6.pdf&src-supplier=NAC+Semi; ComponentLink4URL: http://www.yageo.com/NewPortal/yageodocoutput?fileName=/pdf/R-Chip/PYu-AC_51_RoHS_L_6.pdf&src-supplier=Rutronik; ComponentLink4Description: http://www.yageo.com/NewPortal/yageodocoutput?fileName=/pdf/R-Chip/PYu-AC_51_RoHS_L_6.pdf&src-supplier=Rutronik; Supplier 1: Digikey; Supplier Part Number 1: 311-10KLGCT-ND; RoHS: Yes; Category: Chip SMD Resistors; Stock 1: 480247; Pricing 1: 1=0,1, 10=0,031, 50=0,0198, 100=0,0166, 500=0,01152, 1000=0,00997 (USD); Value: 10k
R11 = R_0R_b: Resistor SMD 0805; Manufacturer: Stackpole Electronics; Manufacturer Part Number: RMCF0805ZT0R00; Power Rating: 125mW; Temperature Coefficient: 200ppm/°C; Voltage Rating: 150V; Mounting Technology: Surface Mount; Case/Package: 0805; Case Code (Metric): 2012; Case Code (Imperial): 0805; Contact Plating: Tin,Matte; Min Operating Temperature: -55°C; Max Operating Temperature: 155°C; Packaging: Tape and Reel; Number of Terminations: 2; Max Power Dissipation: 125mW; Features: Automotive AEC-Q200; Series: RMCF; Construction: Rectangular; Length: 2mm; Width: 0.049inch; Height: 0.026inch; Depth: 1.25mm; Ratings: AEC-Q200; Radiation Hardening: No; Lead Free: Lead Free; Military Standard: Not; RoHS Compliant: Yes; ComponentLink1URL: https://datasheet.ciiva.com/15193/getdatasheetpartid-360417-15193658.pdf?src-supplier=Verical; ComponentLink1Description: https://datasheet.ciiva.com/15193/getdatasheetpartid-360417-15193658.pdf?src-supplier=Verical; Supplier 1: Digikey; Supplier Part Number 1: RMCF0805ZT0R00CT-ND; RoHS: Yes; Category: Chip SMD Resistors; Stock 1: 1321891; Pricing 1: 1=0,1, 10=0,017, 25=0,0128, 50=0,0096, 100=0,0068, 250=0,00544, 500=0,00436, 1000=0,00321 (USD); Value: 0R
R12 = R_1k_b: Resistor SMD 0805; Manufacturer: Bourns; Manufacturer Part Number: CR0805-FX-1001ELF; Tolerance: 1%; Temperature Coefficient: 100ppm/°C; Power Rating: 125mW; Voltage Rating: 150V; Mounting Technology: Surface Mount; Case/Package: 0805; Pins: 2; Contact Plating: Tin; Case Code (Imperial): 0805; Case Code (Metric): 2012; Min Operating Temperature: -55°C; Max Operating Temperature: 155°C; Resistor Type: Thick Film; Packaging: Tape and Reel; Package Quantity: 5000; Termination: SMD/SMT; Number of Terminations: 2; Max Power Dissipation: 125mW; Voltage Rating (DC): 150V; Features: Moisture Resistant; Series: CR0805; Resistance Tolerance: 1%; Technology: THICK FILM; Length: 2mm; Width: 1.25mm; Height: 0.5mm; Depth: 1.25mm; Thickness: 508um; Radiation Hardening: No; Reach SVHC Compliant: No; RoHS Compliant: Yes; ComponentLink1URL: https://datasheet.ciiva.com/11810/0900766b80fcdb72-11810305.pdf?src-supplier=Rs; ComponentLink1Description: https://datasheet.ciiva.com/11810/0900766b80fcdb72-11810305.pdf?src-supplier=Rs; ComponentLink2URL: https://datasheet.ciiva.com/27049/775383-27049976.pdf?src-supplier=Jameco; ComponentLink2Description: https://datasheet.ciiva.com/27049/775383-27049976.pdf?src-supplier=Jameco; ComponentLink3URL: https://datasheet.ciiva.com/7986/1856384-7986222.pdf?src-supplier=Element14; ComponentLink3Description: https://datasheet.ciiva.com/7986/1856384-7986222.pdf?src-supplier=Element14; ComponentLink4URL: https://datasheet.ciiva.com/9123/chpreztr-9123643.pdf?src-supplier=Avnet; ComponentLink4Description: https://datasheet.ciiva.com/9123/chpreztr-9123643.pdf?src-supplier=Avnet; ComponentLink5URL: https://datasheet.ciiva.com/6547/chpreztr-6547422.pdf?src-supplier=Digikey; ComponentLink5Description: https://datasheet.ciiva.com/6547/chpreztr-6547422.pdf?src-supplier=Digikey; ComponentLink6URL: https://datasheet.ciiva.com/6547/chpreztr-6547423.pdf?src-supplier=Digikey; ComponentLink6Description: https://datasheet.ciiva.com/6547/chpreztr-6547423.pdf?src-supplier=Digikey; ComponentLink7URL: https://datasheet.ciiva.com/6547/chpreztr-6547421.pdf?src-supplier=Digikey; ComponentLink7Description: https://datasheet.ciiva.com/6547/chpreztr-6547421.pdf?src-supplier=Digikey; ComponentLink8URL: https://datasheet.ciiva.com/30129/159chpreztr-30129981.pdf?src-supplier=Onlinecomponents.com; ComponentLink8Description: https://datasheet.ciiva.com/30129/159chpreztr-30129981.pdf?src-supplier=Onlinecomponents.com; ComponentLink9URL: https://datasheet.ciiva.com/46394/691949-46394380.pdf?src-supplier=Element14; ComponentLink9Description: https://datasheet.ciiva.com/46394/691949-46394380.pdf?src-supplier=Element14; ComponentLink10URL: https://datasheet.ciiva.com/16722/70154685-16722677.pdf?src-supplier=Allied+Electronics; ComponentLink10Description: https://datasheet.ciiva.com/16722/70154685-16722677.pdf?src-supplier=Allied+Electronics; ComponentLink11URL: https://datasheet.ciiva.com/48692/001055506-da-01-en-smd-wid-cr0805-fx-1001elf-1k-ohm-1-8w-48692106.pdf?src-supplier=Conrad; ComponentLink11Description: https://datasheet.ciiva.com/48692/001055506-da-01-en-smd-wid-cr0805-fx-1001elf-1k-ohm-1-8w-48692106.pdf?src-supplier=Conrad; Supplier 1: Digikey; Supplier Part Number 1: CR0805-FX-1001ELFCT-ND; RoHS: Yes; Category: Chip SMD Resistors; Stock 1: 453972; Pricing 1: 1=0,1, 10=0,021, 50=0,0132, 100=0,011, 500=0,00744, 1000=0,00639 (USD); Value: 1k
U9 = U_W25X40CLSNIG: Supplier 1: Digikey; Supplier Part Number 1: W25X40CLSNIG-ND
Y1 = Y_12MHZ: Supplier 1: Digikey; Supplier Part Number 1: XC2882CT-ND
U7 = U_iCE40HX4K: Supplier 1: Digikey; Supplier Part Number 1: 220-1572-ND